# Altium schematic sheet LED.SchDoc: Cubesat Backplane LED
size B; CompanyName: ENGINEERING & TECHNICAL SERVICES; DrawnBy: C. Kornowski; Engineer: C. Kornowski; Organization: TECHNOLOGY DEVELOPMENT & ENGINEERING CENTER; Address1: 11401 HOOVER ROAD; Address2: MILAN, OH  44846; DocumentNumber: RD17-7000; Revision: INIT; SheetNumber: 5; SheetTotal: 5; PageSetup: Record=PageOptions|CenterHorizontal=True|CenterVertical=True|PrintScale=1.09|XCorrection=1.00|YCorrection=1.00|PrintKind=1|BorderSize=5000000|LeftOffset=0|BottomOffset=0|Orientation=2|PaperLength=1000|PaperWidth=1000|Scale=100|PaperSource=7|PrintQuality=600|MediaType=1|DitherType=10|PaperKind=11x17|PrintScaleMode=1
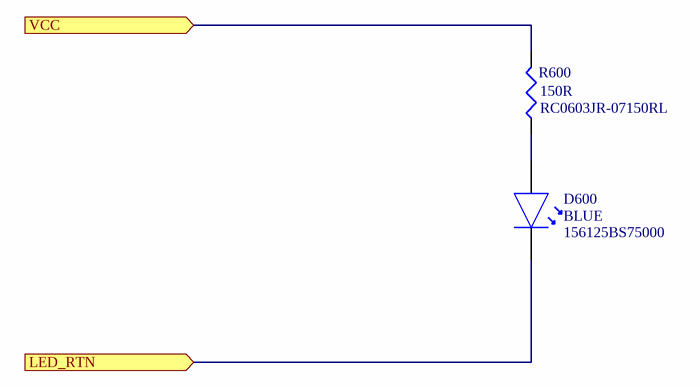
[diagram p0: LED.SchDoc]

## Parts
D600  BLUE  [WL-SMRW_1205_BLU]
R600  150R  Manufacturer Part Number 1: RC0603JR-07150RL  [0603]

## Ports
LED_RTN (in), VCC (in)

## Nets
LED_RTN: D600.K ; port LED_RTN
VCC: R600.2 ; port VCC
NetD600_A: D600.A R600.1

## Notes on the sheet
- DCN
- REV
- DESCRIPTION
- REVISION HISTORY
- DATE
- APPROVED
- SIZE
- TITLE
- CAGE CODE
- DWG NO.
- DRAWN BY
- B
- 01HY9
- ENGINEER
- FILE NAME
- SHEET
- PRINTED:
- OF

## Library data of the parts
D600 = 156125BS75000: WL-SMRW SMD MONO-COLOR REVERSE MOUNT. Blue 470nm LED Indication - Discrete 3.2V 1205 (3212 Metric); Manufacturer 1: Wurth Electronics; Supplier 1: Digi-Key; Supplier Part Number 1: 732-13392-1-ND; Stock 1: 2740; Pricing 1: 1=0.40000, 10=0.34800, 100=0.31000, 500=0.28200, 1000=0.26156 (USD); RoHS: No; Manufacturer Part Number 1: 156125BS75000
R600 = RES1: RES SMD 150 OHM 5% 1/10W 0603; Manufacturer 1: Yageo; Voltage Rating (DC): 50V; Temperature Coefficient: 100ppm/°C; Power Rating: 100mW; ComponentLink1URL: https://datasheet.ciiva.com/2454/pyu-r-int-thick-7-2454513.pdf?src-supplier=Digi-Key; ComponentLink1Description: https://datasheet.ciiva.com/2454/pyu-r-int-thick-7-2454513.pdf?src-supplier=Digi-Key; ComponentLink2URL: https://datasheet.ciiva.com/2454/pyu-r-int-thick-7-2454514.pdf?src-supplier=Digi-Key; ComponentLink2Description: https://datasheet.ciiva.com/2454/pyu-r-int-thick-7-2454514.pdf?src-supplier=Digi-Key; ComponentLink3URL: https://datasheet.ciiva.com/2454/pyu-r-int-thick-7-2454515.pdf?src-supplier=Digi-Key; ComponentLink3Description: https://datasheet.ciiva.com/2454/pyu-r-int-thick-7-2454515.pdf?src-supplier=Digi-Key; ComponentLink4URL: https://datasheet.ciiva.com/46440/1868787-46440895.pdf?src-supplier=Element14; ComponentLink4Description: https://datasheet.ciiva.com/46440/1868787-46440895.pdf?src-supplier=Element14; Supplier 1: Digi-Key; Supplier Part Number 1: 311-150GRCT-ND; Stock 1: 2413445; Pricing 1: 1=0.10000, 10=0.01900, 100=0.00770, 1000=0.00347, 2500=0.00301 (USD); RoHS: Yes; Case/Package: 0603; Number of Pins: 2; Case Code (Imperial): 0603; Case Code (Metric): 1608; Min Operating Temperature: -55°C; Max Operating Temperature: 155°C; Value: 150R; Tolerance: 5%; Packaging: Tape and Reel; Composition: Thick Film; Voltage Rating: 50V; Termination: SMD/SMT; Military Standard: Not; Length: 1.6mm; Width: 0.8mm; Depth: 0.8mm; REACH SVHC: No SVHC; Lead Free: Lead Free; ComponentLink5URL: https://datasheet.ciiva.com/7746/443971-7746441.pdf?src-supplier=Element14; ComponentLink5Description: https://datasheet.ciiva.com/7746/443971-7746441.pdf?src-supplier=Element14; ComponentLink6URL: https://datasheet.ciiva.com/7746/443971-7746442.pdf?src-supplier=Element14; ComponentLink6Description: https://datasheet.ciiva.com/7746/443971-7746442.pdf?src-supplier=Element14; ComponentLink7URL: https://datasheet.ciiva.com/46395/443971-46395087.pdf?src-supplier=Element14; ComponentLink7Description: https://datasheet.ciiva.com/46395/443971-46395087.pdf?src-supplier=Element14